# Altium project 7Seg_Display_Board.PrjPcb
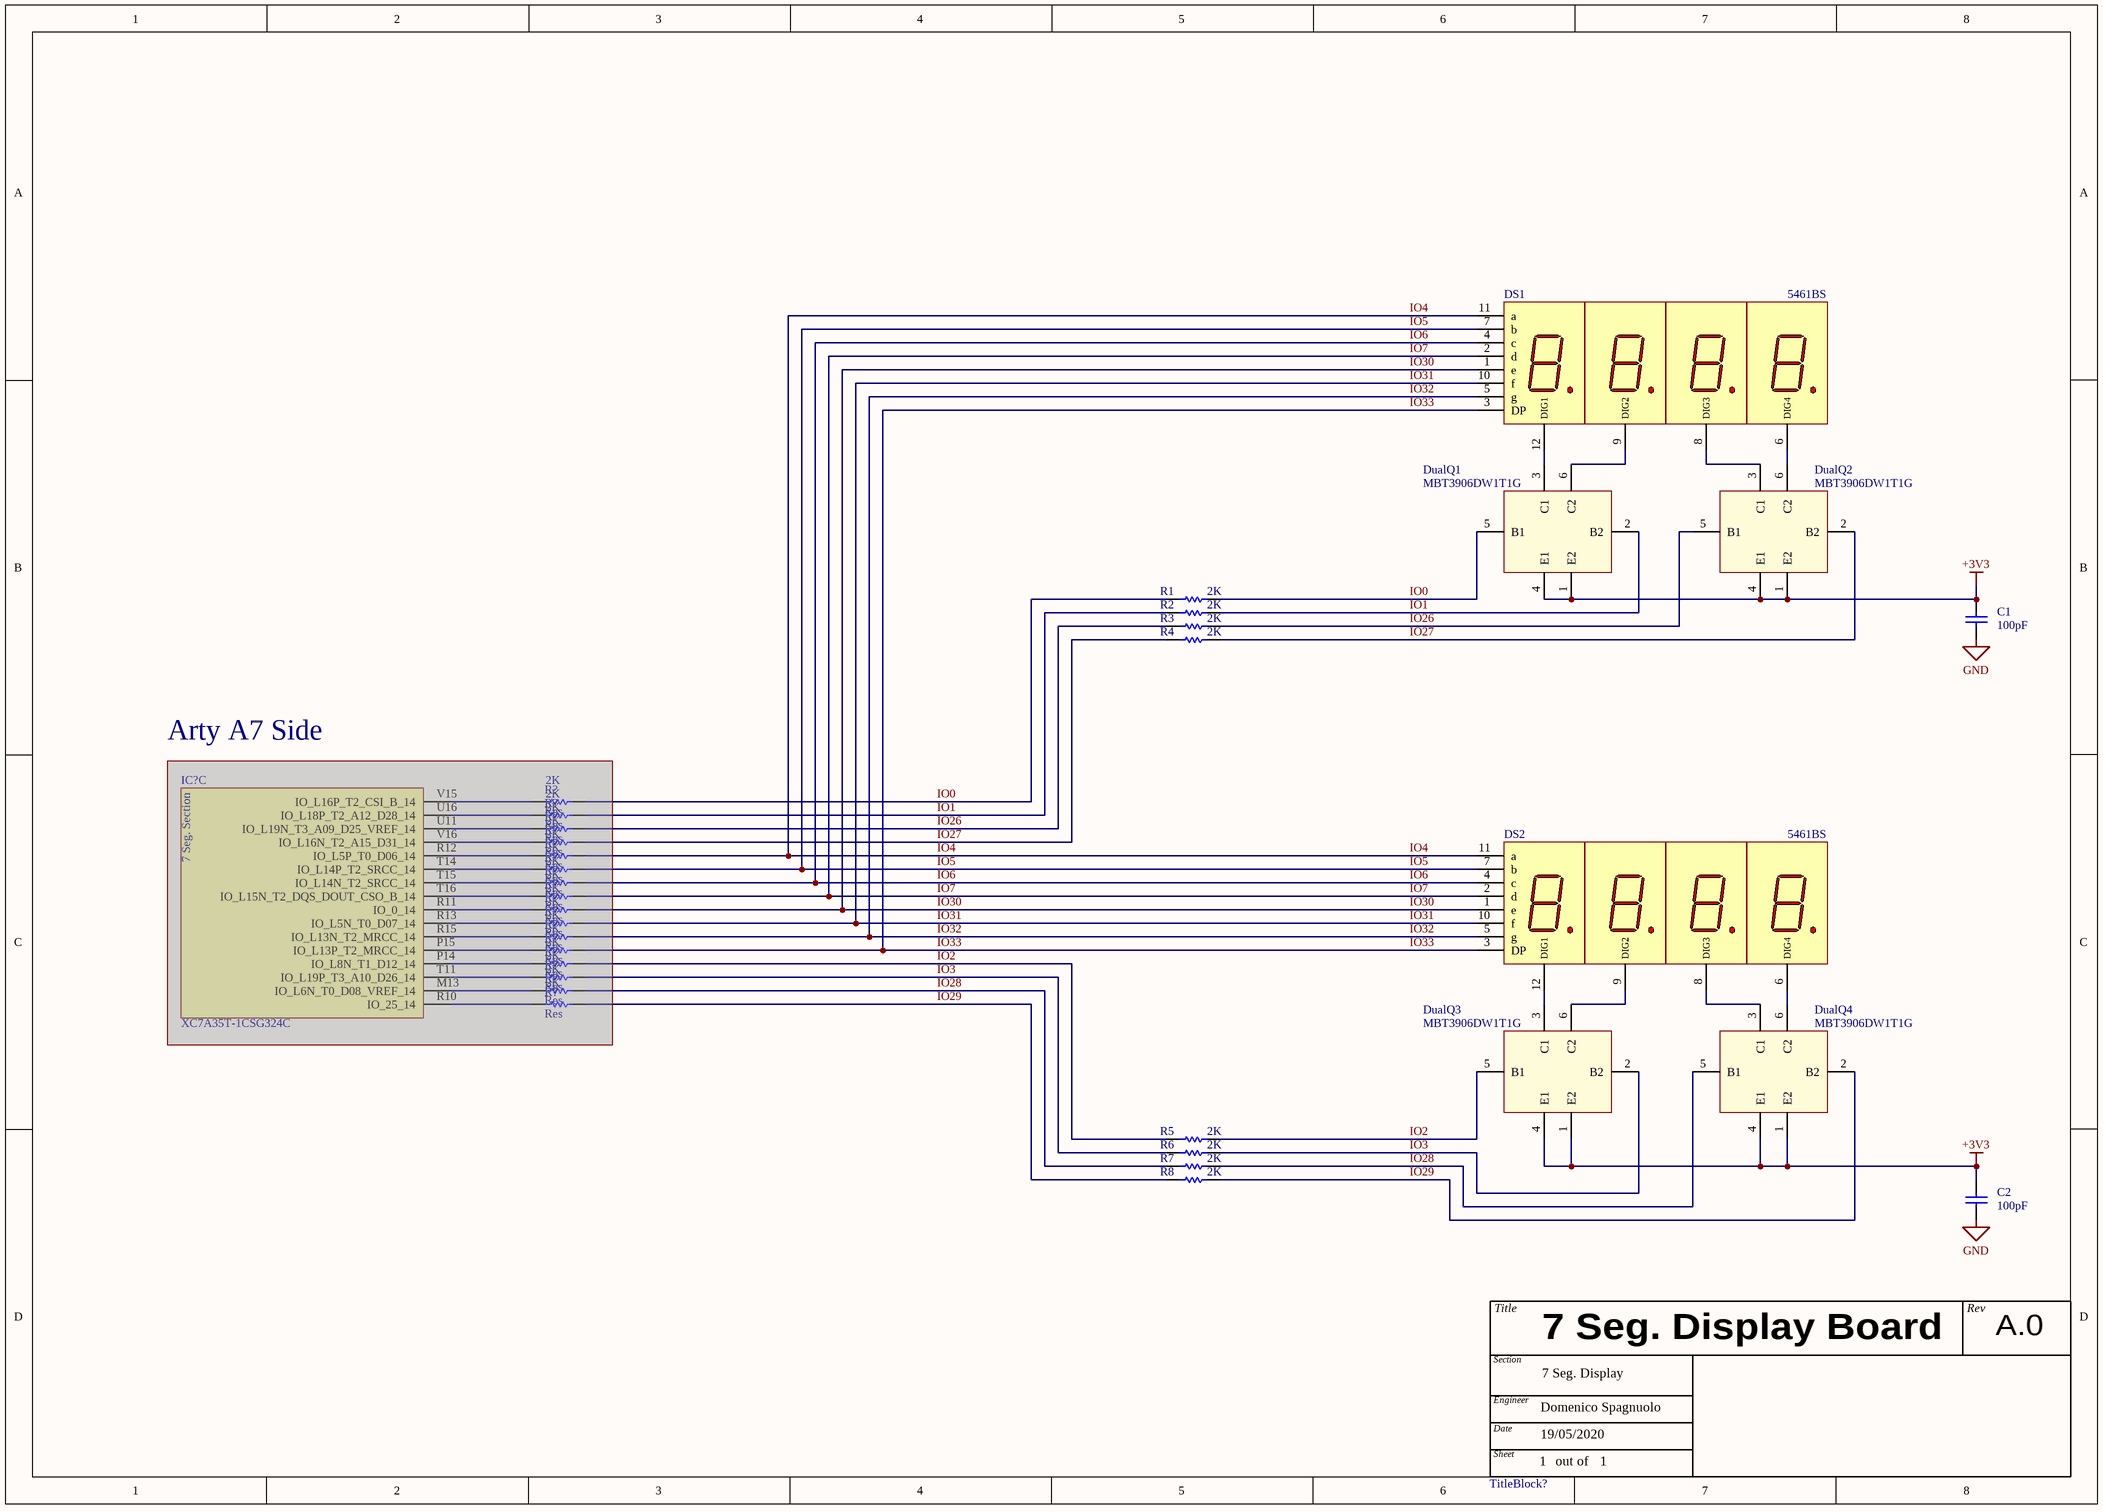
[diagram p0: 7Seg_Display_Board.SchDoc]
Rev: A.0; Section: 7 Seg. Display
1 sheet, 34 parts. Net scope: global (net labels, ports and power ports of the same name join across sheets).

## Sheet 7Seg_Display_Board.SchDoc
size A3; Date: 19/05/2020; Engineer: Domenico Spagnuolo; DocumentNumber: 1; SheetNumber: 1; SheetTotal: 1

### Parts
(Parts that share a designator on the sheet are numbered #1, #2 ... from top to bottom, then left to right.)
C1  value 100pF  [CAP 0805]  (hidden comment: Cap)
C2  value 100pF  [CAP 0805]  (hidden comment: Cap)
DS1  5461BS  [5461BS]
DS2  5461BS  [5461BS]
DualQ1  MBT3906DW1T1G  [MBT3906DW1T1G]
DualQ2  MBT3906DW1T1G  [MBT3906DW1T1G]
DualQ3  MBT3906DW1T1G  [MBT3906DW1T1G]
DualQ4  MBT3906DW1T1G  [MBT3906DW1T1G]
IC?  XC7A35T-1CSG324C  [BGA324C80P18X18_1500X1500X150]  (part C of 3)  (masked out: inside a compile mask, not in the netlist)
R1  value 2K  [RES 0805]  (hidden comment: Res)
R2  value 2K  [RES 0805]  (hidden comment: Res)
R3  value 2K  [RES 0805]  (hidden comment: Res)
R4  value 2K  [RES 0805]  (hidden comment: Res)
R5  value 2K  [RES 0805]  (hidden comment: Res)
R6  value 2K  [RES 0805]  (hidden comment: Res)
R7  value 2K  [RES 0805]  (hidden comment: Res)
R8  value 2K  [RES 0805]  (hidden comment: Res)
R?#1  Res  value 2K  [RES 0805]  (masked out: inside a compile mask, not in the netlist)
R?#2  Res  value 2K  [RES 0805]  (masked out: inside a compile mask, not in the netlist)
R?#3  Res  value 2K  [RES 0805]  (masked out: inside a compile mask, not in the netlist)
R?#4  Res  value 2K  [RES 0805]  (masked out: inside a compile mask, not in the netlist)
R?#5  Res  value 2K  [RES 0805]  (masked out: inside a compile mask, not in the netlist)
R?#6  Res  value 2K  [RES 0805]  (masked out: inside a compile mask, not in the netlist)
R?#7  Res  value 2K  [RES 0805]  (masked out: inside a compile mask, not in the netlist)
R?#8  Res  value 2K  [RES 0805]  (masked out: inside a compile mask, not in the netlist)
R?#9  Res  value 2K  [RES 0805]  (masked out: inside a compile mask, not in the netlist)
R?#10  Res  value 2K  [RES 0805]  (masked out: inside a compile mask, not in the netlist)
R?#11  Res  value 2K  [RES 0805]  (masked out: inside a compile mask, not in the netlist)
R?#12  Res  value 2K  [RES 0805]  (masked out: inside a compile mask, not in the netlist)
R?#13  Res  value 2K  [RES 0805]  (masked out: inside a compile mask, not in the netlist)
R?#14  Res  value 2K  [RES 0805]  (masked out: inside a compile mask, not in the netlist)
R?#15  Res  value 2K  [RES 0805]  (masked out: inside a compile mask, not in the netlist)
R?#16  Res  value 2K  [RES 0805]  (masked out: inside a compile mask, not in the netlist)
TitleBlock?  Title Block  (value not drawn)  (graphical)

### Nets
+3V3: C1.2 C2.2 DualQ1.1(E2) DualQ1.4(E1) DualQ2.1(E2) DualQ2.4(E1) DualQ3.1(E2) DualQ3.4(E1) DualQ4.1(E2) DualQ4.4(E1)
GND: C1.1 C2.1
IO0: DualQ1.5(B1) R1.1 R1.2
IO1: DualQ1.2(B2) R2.1 R2.2
IO2: DualQ3.5(B1) R5.1 R5.2
IO3: DualQ3.2(B2) R6.1 R6.2
IO4: DS1.11(a) DS2.11(a)
IO5: DS1.7(b) DS2.7(b)
IO6: DS1.4(c) DS2.4(c)
IO7: DS1.2(d) DS2.2(d)
IO26: DualQ2.5(B1) R3.1 R3.2
IO27: DualQ2.2(B2) R4.1 R4.2
IO28: DualQ4.5(B1) R7.1 R7.2
IO29: DualQ4.2(B2) R8.1 R8.2
IO30: DS1.1(e) DS2.1(e)
IO31: DS1.10(f) DS2.10(f)
IO32: DS1.5(g) DS2.5(g)
IO33: DS1.3(DP) DS2.3(DP)
NetDS1_6: DS1.6(DIG4) DualQ2.6(C2)
NetDS1_8: DS1.8(DIG3) DualQ2.3(C1)
NetDS1_9: DS1.9(DIG2) DualQ1.6(C2)
NetDS1_12: DS1.12(DIG1) DualQ1.3(C1)
NetDS2_6: DS2.6(DIG4) DualQ4.6(C2)
NetDS2_8: DS2.8(DIG3) DualQ4.3(C1)
NetDS2_9: DS2.9(DIG2) DualQ3.6(C2)
NetDS2_12: DS2.12(DIG1) DualQ3.3(C1)

### Notes on the sheet
- Arty A7 Side
- (in symbol TitleBlock) Title; Rev; 7 Seg. Display Board; Section; Engineer; Date; Sheet; out of
- (in symbol XC7A35T-1CSG324C, part C) 7 Seg. Section

### Library data of the parts
C1 C2 = Cap: Capacitor; Published: 8-Jun-2000; LatestRevisionDate: 17-Jul-2002; LatestRevisionNote: Re-released for DXP Platform.; PackageReference: RAD-0.3; Publisher: Altium Limited; PackageDescription: Radial Cap, Thru-Hole; 2 Leads; 0.3 in Pin Spacing
DS1 DS2 = 5461BS: 4 Digit Display (Red); MinimumIntensity: 360 ucd; Note: Pins 1 and 6 are redundant Anodes.; Colour: High Efficiency Red (HER); Published: 8-Jun-2000; LatestRevisionDate: 17-Dec-2003; LatestRevisionNote: Schematic revised, PCB Footprint replaced.; DatasheetVersion: 19-Feb-2002; PackageVersion: 11-Feb-2002; PackageReference: A; Publisher: Altium Limited; PackageDescription: LED, 7-Segment Display, 7.62 mm, RHD; 10 Leads; Row Space 5.08 mm; Pitch 2.54 mm; ComponentLink1Description: Manufacturer Link; ComponentLink1URL: http://www.agilent.com/
DualQ1-DualQ4 = MBT3906DW1T1G: Dual Transistors; Manufacturer_Name: ON Semiconductor; Datasheet Link: http://www.onsemi.com/pub/Collateral/MBT3906DW1T1-D.PDF; Height: 1.1mm; Manufacturer_Part_Number: MBT3906DW1T1G; Mouser Part Number: 863-MBT3906DW1T1G; Mouser Price/Stock: https://www.mouser.com/Search/Refine.aspx?Keyword=863-MBT3906DW1T1G; RS Part Number: 7916075P; RS Price/Stock: http://uk.rs-online.com/web/p/products/7916075P; Name: MBT3906DW1T1G
IC? = XC7A35T-1CSG324C: Integrated Circuit; Manufacturer_Name: XILINX; Datasheet Link: http://www.xilinx.com/support/documentation/data_sheets/ds180_7Series_Overview.pdf; Height: 1.5mm; Manufacturer_Part_Number: XC7A35T-1CSG324C; Mouser Part Number: 217-XC7A35T-1CSG324C; Mouser Price/Stock: https://www.mouser.co.uk/ProductDetail/Xilinx/XC7A35T-1CSG324C?qs=rrS6PyfT74cxvR58nHYPWA%3D%3D
R1-R8 R?#1-R?#16 = Res: Resistor; Published: 8-Jun-2000; LatestRevisionDate: 17-Jul-2002; LatestRevisionNote: Re-released for DXP Platform.; PackageReference: AXIAL-0.3; Publisher: Altium Limited; PackageDescription: Axial Device, Thru-Hole; 2 Leads; 0.3 in Pin Spacing
TitleBlock? = TitleBlock